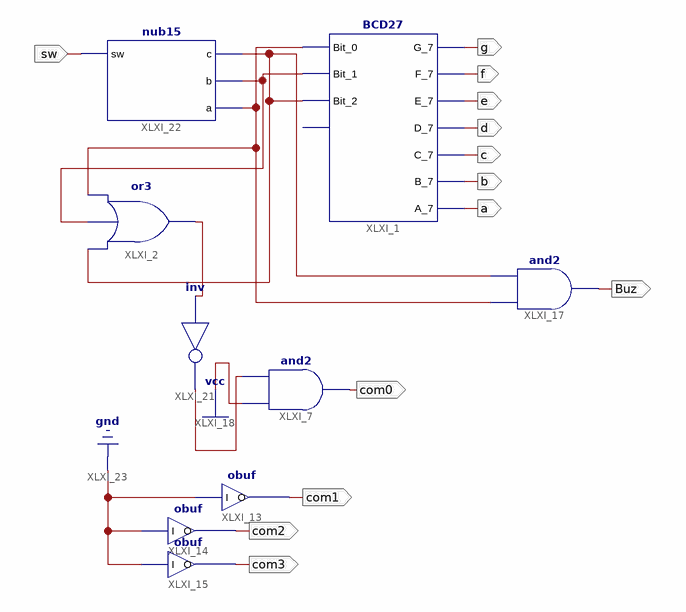
[diagram p0: schematic sheet 1]
// Xilinx ISE schematic testDeb.sch (spartan6) as structural Verilog: 9 symbols, 13 ports
module testDeb (
  input  sw,
  output g,
  output f,
  output e,
  output d,
  output c,
  output b,
  output a,
  output com2,
  output com1,
  output com3,
  output Buz,
  output com0
);

  wire XLXN_3, XLXN_5, XLXN_8, XLXN_33, XLXN_34;

  BCD27 XLXI_1 (
    .A_7(a), .Bit_0(XLXN_5), .Bit_1(XLXN_3), .Bit_2(XLXN_8), .B_7(b), .C_7(c), .D_7(d), .E_7(e), .F_7(f),
    .G_7(g));  // open: Bit_3
  or XLXI_2 (XLXN_33, XLXN_8, XLXN_3, XLXN_5);
  obuf XLXI_13 (.I(1'b0), .O(com1));
  obuf XLXI_14 (.I(1'b0), .O(com2));
  obuf XLXI_15 (.I(1'b0), .O(com3));
  and XLXI_17 (Buz, XLXN_5, XLXN_8);
  and XLXI_7 (com0, 1'b1, XLXN_34);
  not XLXI_21 (XLXN_34, XLXN_33);
  nub15 XLXI_22 (.a(XLXN_5), .b(XLXN_3), .c(XLXN_8), .sw(sw));
endmodule
